# Altium schematic sheet OPENMV4_BASE.SchDoc
size A3
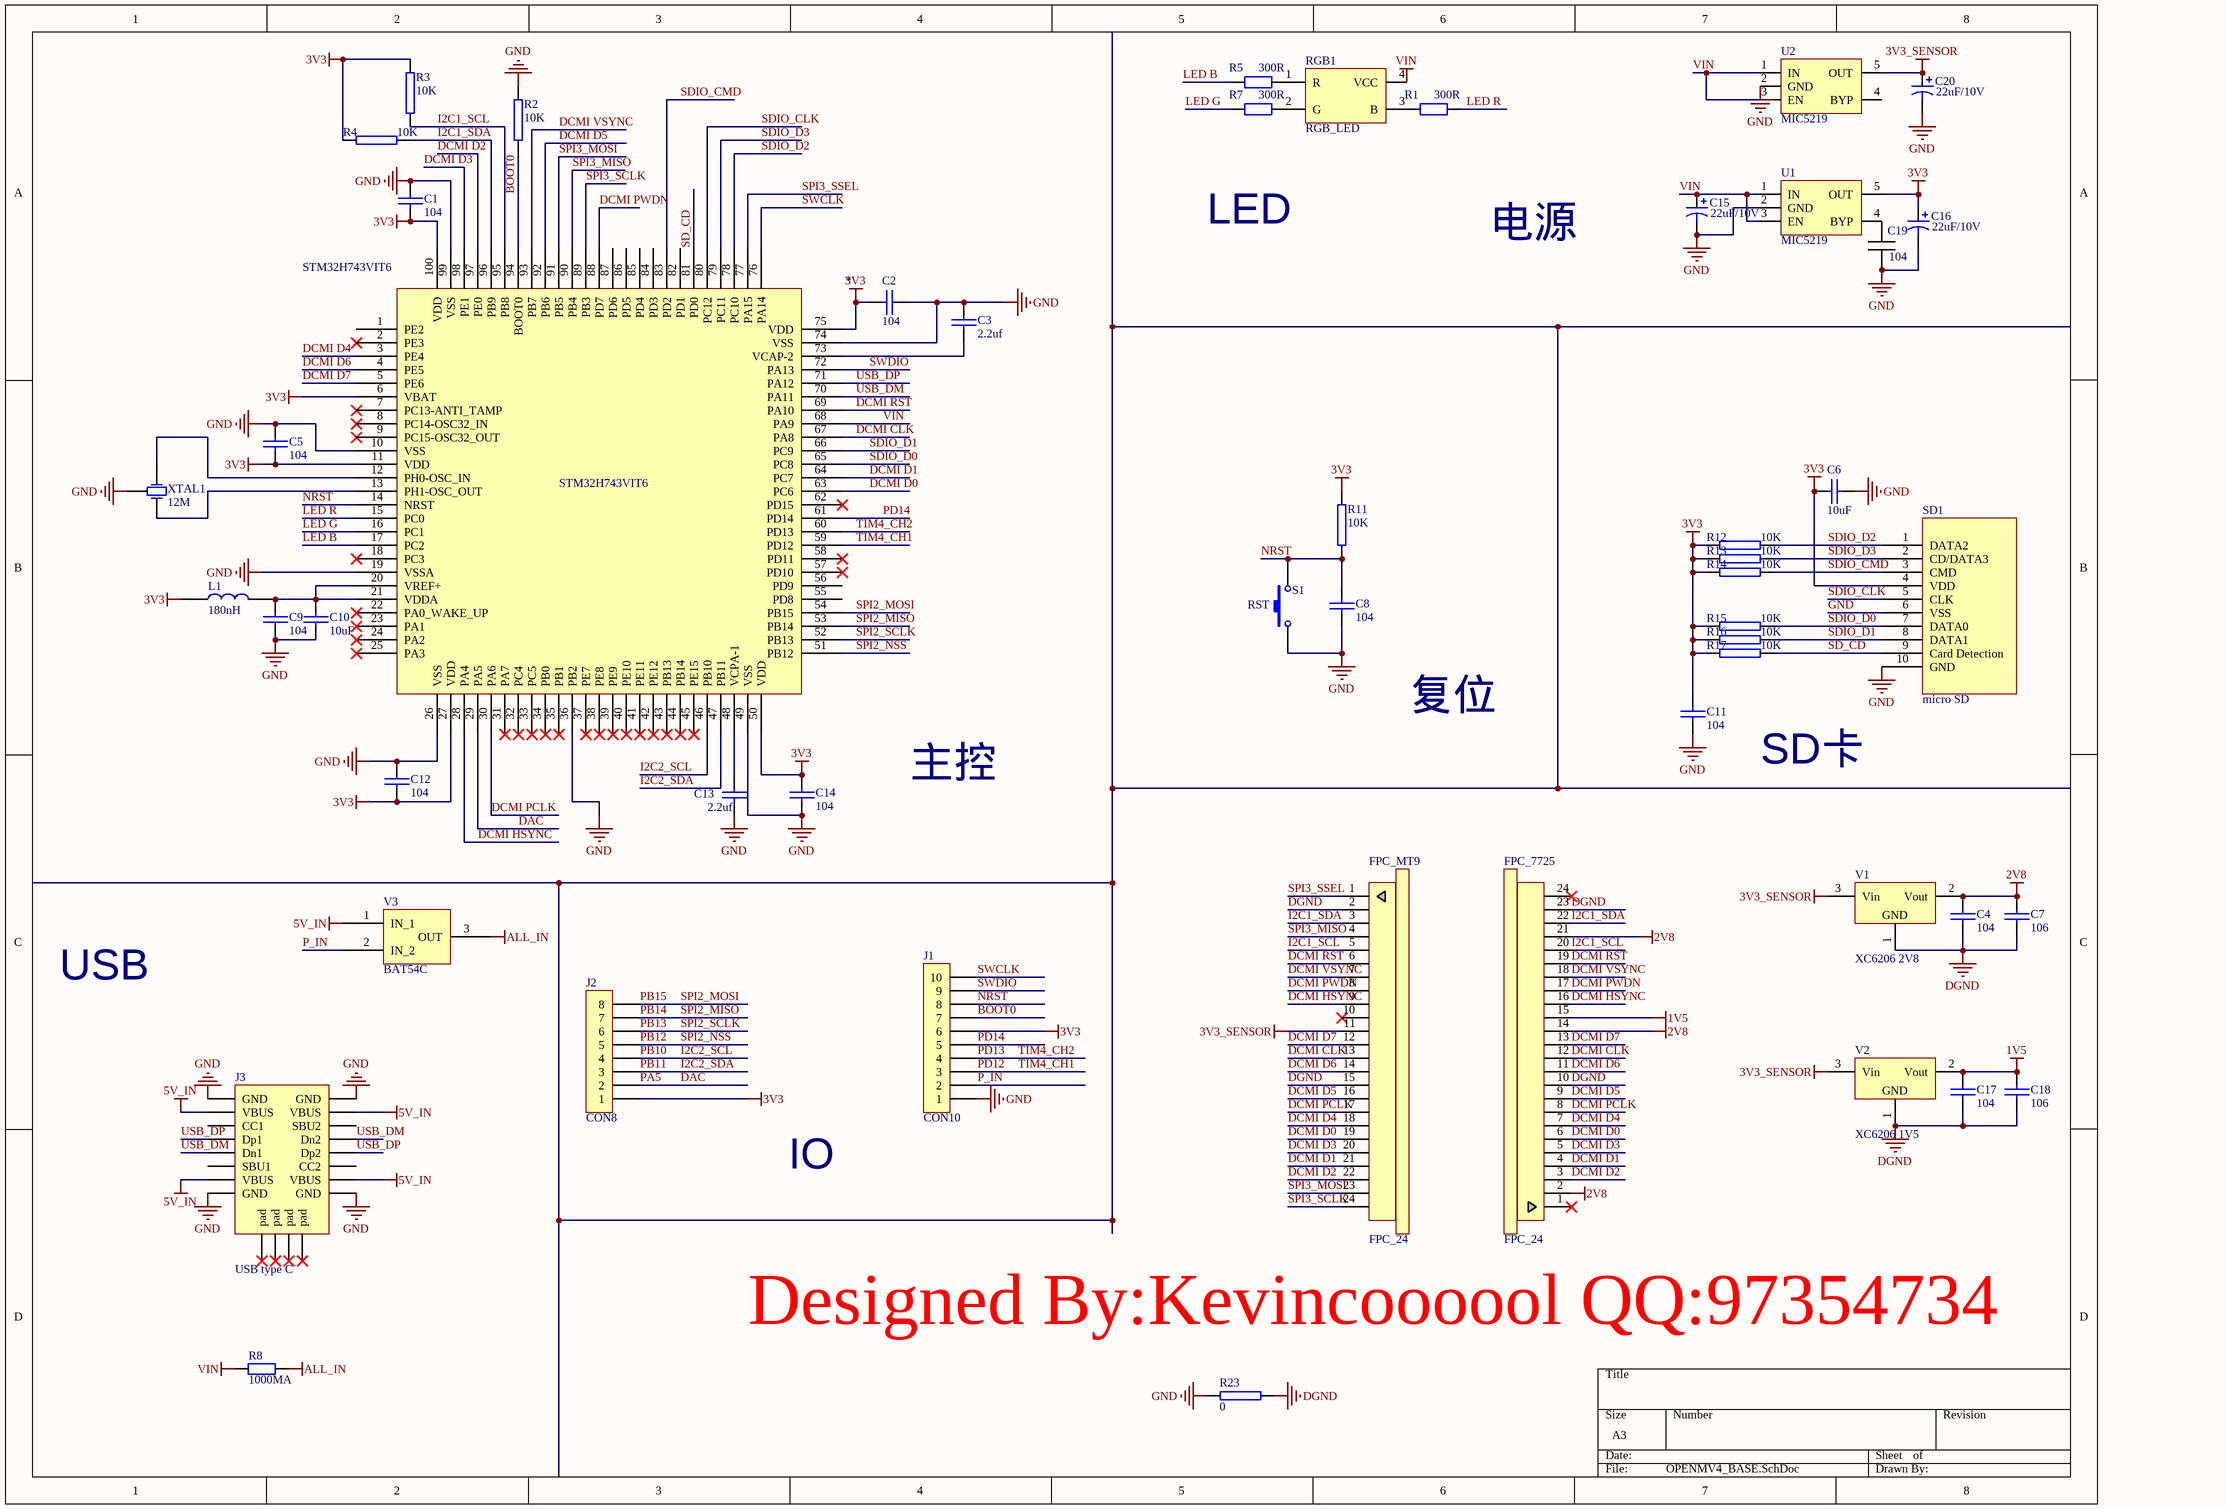
[diagram p0: OPENMV4_BASE.SchDoc]

## Parts
*  STM32H743VIT6  [LQFP100 14x14_N]
C1  104  [LC-0603_C]
C2  104  [LC-0603_C]
C3  2.2uf  [LC-0603_C]
C4  104  [0603_C]
C5  104  [LC-0603_C]
C6  10uF  [LC-0805_C]
C7  106  [0603_C]
C8  104  [LC-0603_C]
C9  104  [LC-0603_C]
C10  10uF  [LC-0603_C]
C11  104  [LC-0603_C]
C12  104  [LC-0603_C]
C13  2.2uf  [LC-0603_C]
C14  104  [LC-0603_C]
C15  value 22uF/10V  [LC-1206_C]  (hidden comment: 47uF)
C16  value 22uF/10V  [LC-1206_C]  (hidden comment: 47uF)
C17  104  [0603_C]
C18  106  [0603_C]
C19  104  [LC-0603_C]
C20  value 22uF/10V  [LC-1206_C]  (hidden comment: 47uF)
FPC_7725  FPC_24  [FPC_24]
FPC_MT9  FPC_24  [FPC_24]
J1  CON10  [HDR1X10]
J2  CON8  [HDR1X8]
J3  USB type C  [USB Type-C-16Pin_A]
L1  180nH  [LC-0603_L]
R1  value 300R  [0603_R]  (hidden comment: 1K)
R2  10K  [LC-0603_R]
R3  10K  [LC-0603_R]
R4  10K  [LC-0603_R]
R5  value 300R  [0603_R]  (hidden comment: 1K)
R7  value 300R  [0603_R]  (hidden comment: 1K)
R8  value 1000MA  [LC-0805_L]  (hidden comment: 1A保险丝)
R11  10K  [LC-0603_R]
R12  10K  [LC-0603_R]
R13  10K  [LC-0603_R]
R14  10K  [LC-0603_R]
R15  10K  [LC-0603_R]
R16  10K  [LC-0603_R]
R17  10K  [LC-0603_R]
R23  0  [LC-0603_R]
RGB1  RGB_LED  [LED_3528_RGB]
S1  RST  [KEY_1]
SD1  micro SD  [TF卡座]
U1  MIC5219  [SOT23-5N]
U2  MIC5219  [SOT23-5N]
V1  XC6206 2V8  [SOT23-3N]
V2  XC6206 1V5  [SOT23-3N]
V3  BAT54C  [SOT23-3N]
XTAL1  12M  [XTAL-3215-3P]

## Nets
1V5: C17.1 C18.1 FPC_7725.15 V2.2(Vout)
2V8: C4.1 C7.1 FPC_7725.2 FPC_7725.14 FPC_7725.21 V1.2(Vout)
3V3: *.6(VBAT) *.11(VDD) *.27(VDD) *.50(VDD) *.75(VDD) *.100(VDD) C1.2 C2.2 C5.2 C6.2 C11.2 C12.2 C14.2 C16.1 J1.6 J2.1 L1.1 R3.2 R4.1 R11.1 R12.1 R13.1 R14.1 R15.1 R16.1 R17.1 SD1.4(VDD) U1.5(OUT)
3V3_SENSOR: C20.1 FPC_MT9.11 U2.5(OUT) V1.3(Vin) V2.3(Vin)
5V_IN: J3.A4(VBUS) J3.A9(VBUS) J3.B4(VBUS) J3.B9(VBUS) V3.1(IN_1)
ALL_IN: R8.2 V3.3(OUT)
DGND: C4.2 C7.2 C17.2 C18.2 FPC_7725.10 FPC_7725.23 FPC_MT9.2 FPC_MT9.15 R23.2 V1.1(GND) V2.1(GND)
GND: *.10(VSS) *.19(VSSA) *.26(VSS) *.36(PB2) *.49(VSS) *.74(VSS) *.99(VSS) C1.1 C2.1 C3.2 C5.1 C6.1 C8.1 C9.2 C10.2 C11.1 C12.1 C13.2 C14.1 C15.2 C16.2 C19.1 C20.2 J1.1 J3.A1(GND) J3.A12(GND) J3.B1(GND) J3.B12(GND) R2.2 R23.1 S1.1 SD1.6(VSS) SD1.10(GND) U1.2(GND) U2.2(GND) XTAL1.2
VIN: *.68(PA9) C15.1 R8.1 RGB1.4(VCC) U1.1(IN) U1.3(EN) U2.1(IN) U2.3(EN)
BOOT0: *.94(BOOT0) J1.7 R2.1
DAC: *.29(PA5) J2.2  [also labelled PA5]
DCMI CLK: *.67(PA8) FPC_7725.12 FPC_MT9.13
DCMI D0: *.63(PC6) FPC_7725.6 FPC_MT9.19
DCMI D1: *.64(PC7) FPC_7725.4 FPC_MT9.21
DCMI D2: *.97(PE0) FPC_7725.3 FPC_MT9.22
DCMI D3: *.98(PE1) FPC_7725.5 FPC_MT9.20
DCMI D4: *.3(PE4) FPC_7725.7 FPC_MT9.18
DCMI D5: *.92(PB6) FPC_7725.9 FPC_MT9.16
DCMI D6: *.4(PE5) FPC_7725.11 FPC_MT9.14
DCMI D7: *.5(PE6) FPC_7725.13 FPC_MT9.12
DCMI HSYNC: *.28(PA4) FPC_7725.16 FPC_MT9.9
DCMI PCLK: *.30(PA6) FPC_7725.8 FPC_MT9.17
DCMI PWDN: *.88(PD7) FPC_7725.17 FPC_MT9.8
DCMI RST: *.69(PA10) FPC_7725.19 FPC_MT9.6
DCMI VSYNC: *.93(PB7) FPC_7725.18 FPC_MT9.7
I2C1_SCL: *.95(PB8) FPC_7725.20 FPC_MT9.5 R3.1
I2C1_SDA: *.96(PB9) FPC_7725.22 FPC_MT9.3 R4.2
I2C2_SCL: *.46(PB10) J2.4  [also labelled PB10]
I2C2_SDA: *.47(PB11) J2.3  [also labelled PB11]
LED B: *.17(PC2) R5.1
LED G: *.16(PC1) R7.1
LED R: *.15(PC0) R1.2
NRST: *.14(NRST) C8.2 J1.8 R11.2 S1.2
P_IN: J1.2 V3.2(IN_2)
PB12: *.51(PB12) J2.5  [also labelled SPI2_NSS]
PB13: *.52(PB13) J2.6  [also labelled SPI2_SCLK]
PB14: *.53(PB14) J2.7  [also labelled SPI2_MISO]
PB15: *.54(PB15) J2.8  [also labelled SPI2_MOSI]
PD12: *.59(PD12) J1.3  [also labelled TIM4_CH1]
PD13: *.60(PD13) J1.4  [also labelled TIM4_CH2]
PD14: *.61(PD14) J1.5
SD_CD: *.81(PD0) R17.2 SD1.9(Card_Detection)
SDIO_CLK: *.80(PC12) SD1.5(CLK)
SDIO_CMD: *.83(PD2) R14.2 SD1.3(CMD)
SDIO_D0: *.65(PC8) R15.2 SD1.7(DATA0)
SDIO_D1: *.66(PC9) R16.2 SD1.8(DATA1)
SDIO_D2: *.78(PC10) R12.2 SD1.1(DATA2)
SDIO_D3: *.79(PC11) R13.2 SD1.2(CD/DATA3)
SPI3_MISO: *.90(PB4) FPC_MT9.4
SPI3_MOSI: *.91(PB5) FPC_MT9.23
SPI3_SCLK: *.89(PB3) FPC_MT9.24
SPI3_SSEL: *.77(PA15) FPC_MT9.1
SWCLK: *.76(PA14) J1.10
SWDIO: *.72(PA13) J1.9
USB_DM: *.70(PA11) J3.A7(Dn1) J3.B7(Dn2)
USB_DP: *.71(PA12) J3.A6(Dp1) J3.B6(Dp2)
Net*_12: *.12(PH0-OSC_IN) XTAL1.1
Net*_13: *.13(PH1-OSC_OUT) XTAL1.3
Net*_20: *.20(VREF+) *.21(VDDA) C9.1 C10.1 L1.2
Net*_48: *.48(VCPA-1) C13.1
Net*_73: *.73(VCAP-2) C3.1
NetC19_2: C19.2 U1.4(BYP)
NetR1_1: R1.1 RGB1.3(B)
NetR5_2: R5.2 RGB1.1(R)
NetR7_2: R7.2 RGB1.2(G)

Not connected (* = marked no-connect by the designer): * 1(PE2) 2(PE3)* 7(PC13-ANTI_TAMP)* 8(PC14-OSC32_IN)* 9(PC15-OSC32_OUT)* 18(PC3)* 22(PA0_WAKE_UP)* 23(PA1)* 24(PA2)* 25(PA3)* 31(PA7)* 32(PC4)* 33(PC5)* 34(PB0)* 35(PB1)* 37(PE7)* 38(PE8)* 39(PE9)* 40(PE10)* 41(PE11)* 42(PE12)* 43(PB13)* 44(PB14)* 45(PE15)* 55(PD8) 56(PD9) 57(PD10)* 58(PD11)* 62(PD15)* 82(PD1) 84(PD3) 85(PD4) 86(PD5) 87(PD6); FPC_7725 1* 24*; FPC_MT9 10*; J3 0(pad)* A5(CC1) A8(SBU1) B5(CC2) B8(SBU2); U2 4(BYP)

## Notes on the sheet
- LED
- 电源
- 复位
- 主控
- SD卡
- USB
- IO
- Designed By:Kevincoooool QQ:97354734

## Library data of the parts
C1-C14 C17 C18 = CAP
C15 C16 C20 = Cap Pol1: Polarized Capacitor (Radial); Published: 8-Jun-2000; LatestRevisionDate: 17-Jul-2002; LatestRevisionNote: Re-released for DXP Platform.; PackageReference: RB7.6-15; Publisher: Altium Limited
C19 = CAP104
J3 = USB_C
L1 = Inductor
R1 R5 R7 R8 = Res2: Resistor; Published: 8-Jun-2000; LatestRevisionDate: 17-Jul-2002; LatestRevisionNote: Re-released for DXP Platform.; PackageReference: AXIAL-0.4; Publisher: Altium Limited
R2-R4 R11-R17 R23 = RES
RGB1 = RGB_LED: 三色高亮LED
S1 = SW-PB: Switch; Published: 24-Mar-1999; LatestRevisionDate: 17-Jul-2002; LatestRevisionNote: Re-released for DXP Platform.; PackageReference: SPST-2; Publisher: Altium Limited; PackageDescription: Switch; 2 Leads
U1 U2 = MIC5219: 3.3V 降压芯片
V1 V2 = XC6206P332MR: 低压差线性稳压芯片; 版权归属: 源创客; BOM名称: 低压差线性稳压芯片; 学习资源: www.ooocke.com
XTAL1 = XTAL_3P